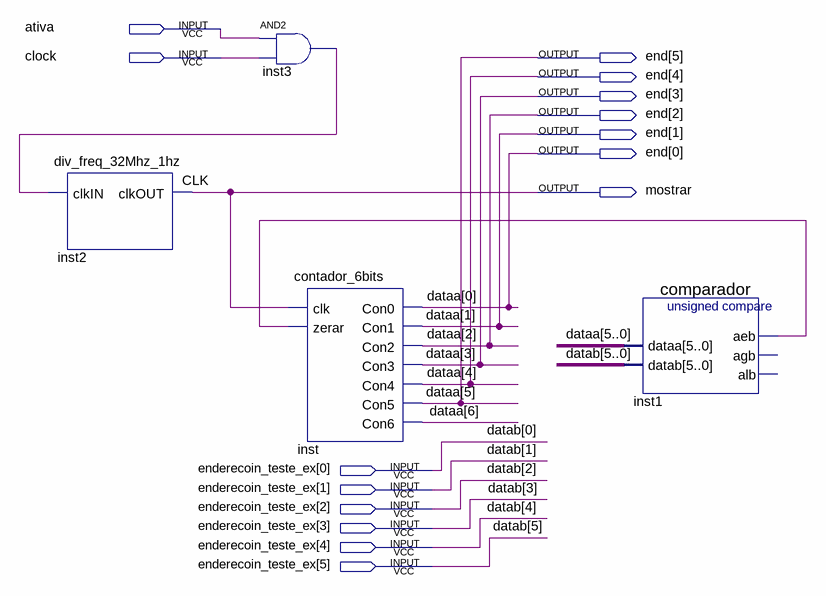
[diagram p0: schematic sheet]
// Quartus schematic mef_exibir.bdf as structural Verilog: 4 symbols, 15 pins
module mef_exibir (
  input  ativa,
  input  clock,
  input  [5:0] enderecoin_teste_ex,
  output [5:0] \end ,
  output mostrar
);

  wire inst1_aeb, inst3_out;
  wire [6:6] dataa;

  div_freq_32Mhz_1hz inst2 (.clkIN(inst3_out), .clkOUT(mostrar));
  and inst3 (inst3_out, ativa, clock);
  contador_6bits inst (
    .clk(mostrar), .zerar(inst1_aeb), .Con0(\end [0]), .Con1(\end [1]), .Con2(\end [2]), .Con3(\end [3]),
    .Con4(\end [4]), .Con5(\end [5]), .Con6(dataa[6]));
  comparador inst1 (.dataa(\end ), .datab(enderecoin_teste_ex), .aeb(inst1_aeb));  // open: agb, alb

  // Other names for the same wires on the sheet: CLK = mostrar; dataa[5:0] = \end ; datab[5:0] = enderecoin_teste_ex
endmodule
